# EasyEDA schematic SCH_airPi_2024-02-11.json

## Sheets
1 airPi_HV: TITLE: airPi_HV; REV: 1.0; Date: 2023-12-18; Sheet: 1/1; Drawn By: Wollwolke
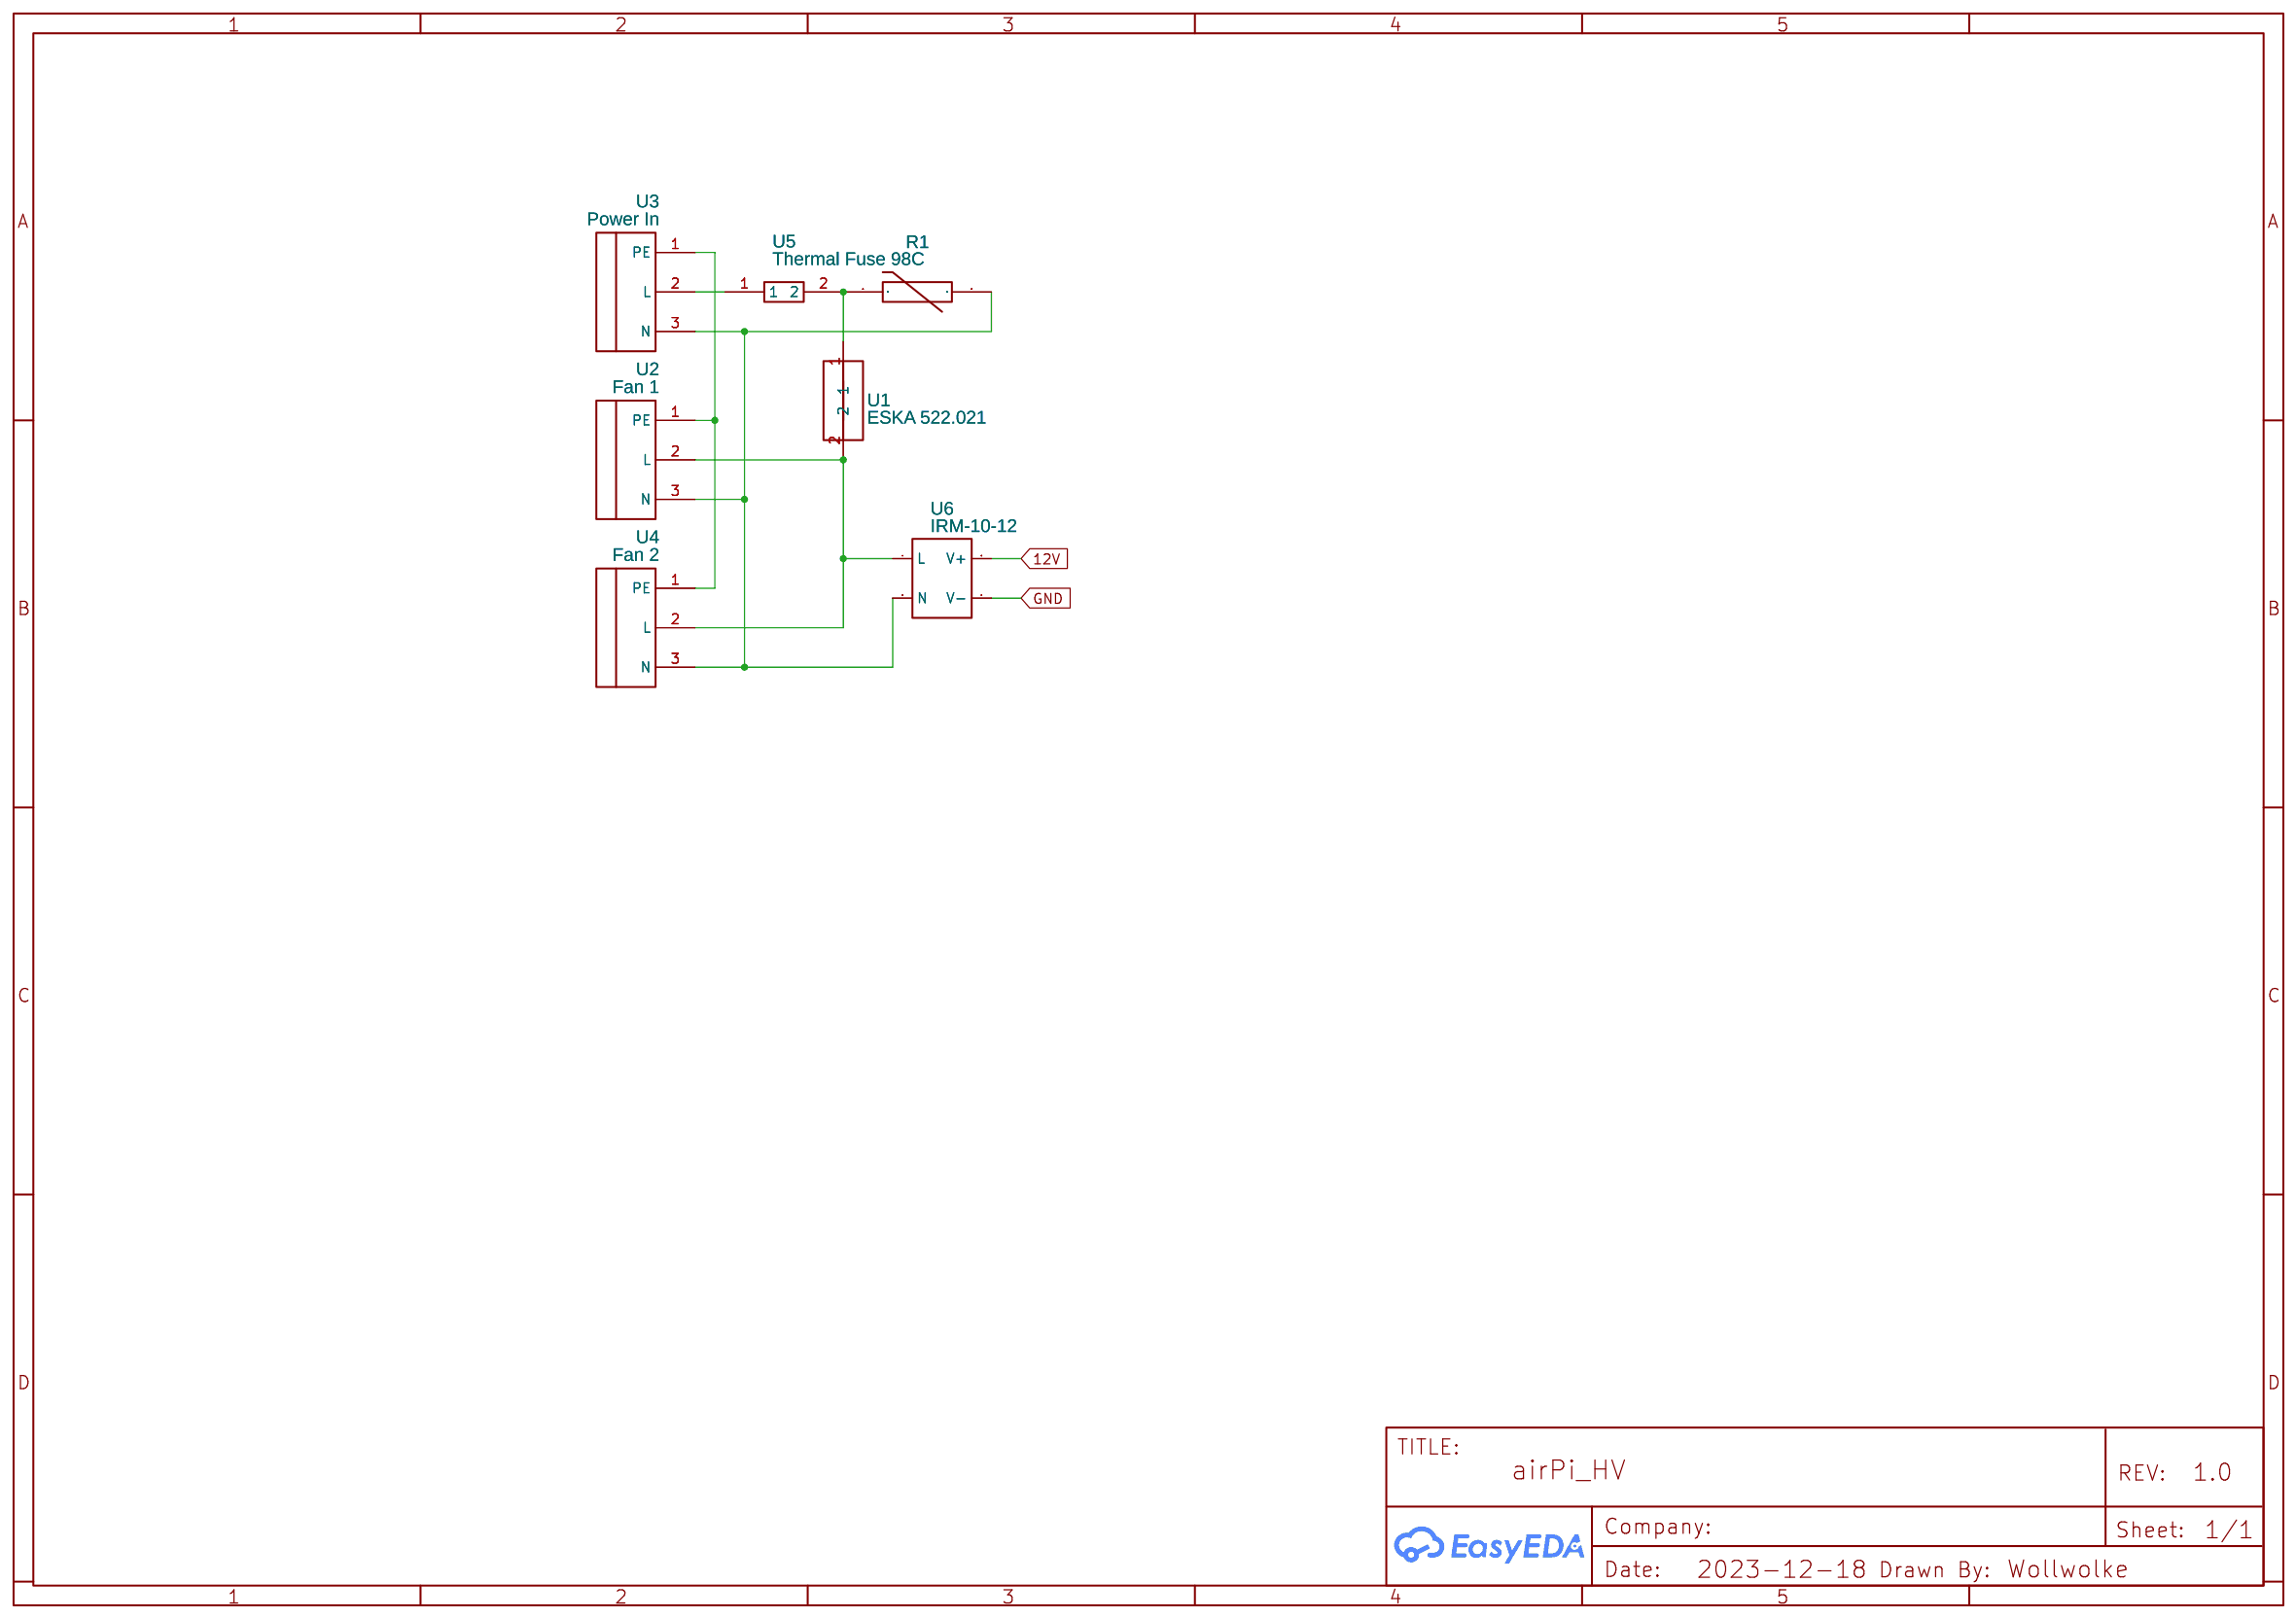
[diagram p0: airPi_HV]
2 airPi_Controller: TITLE: airPi_Controller
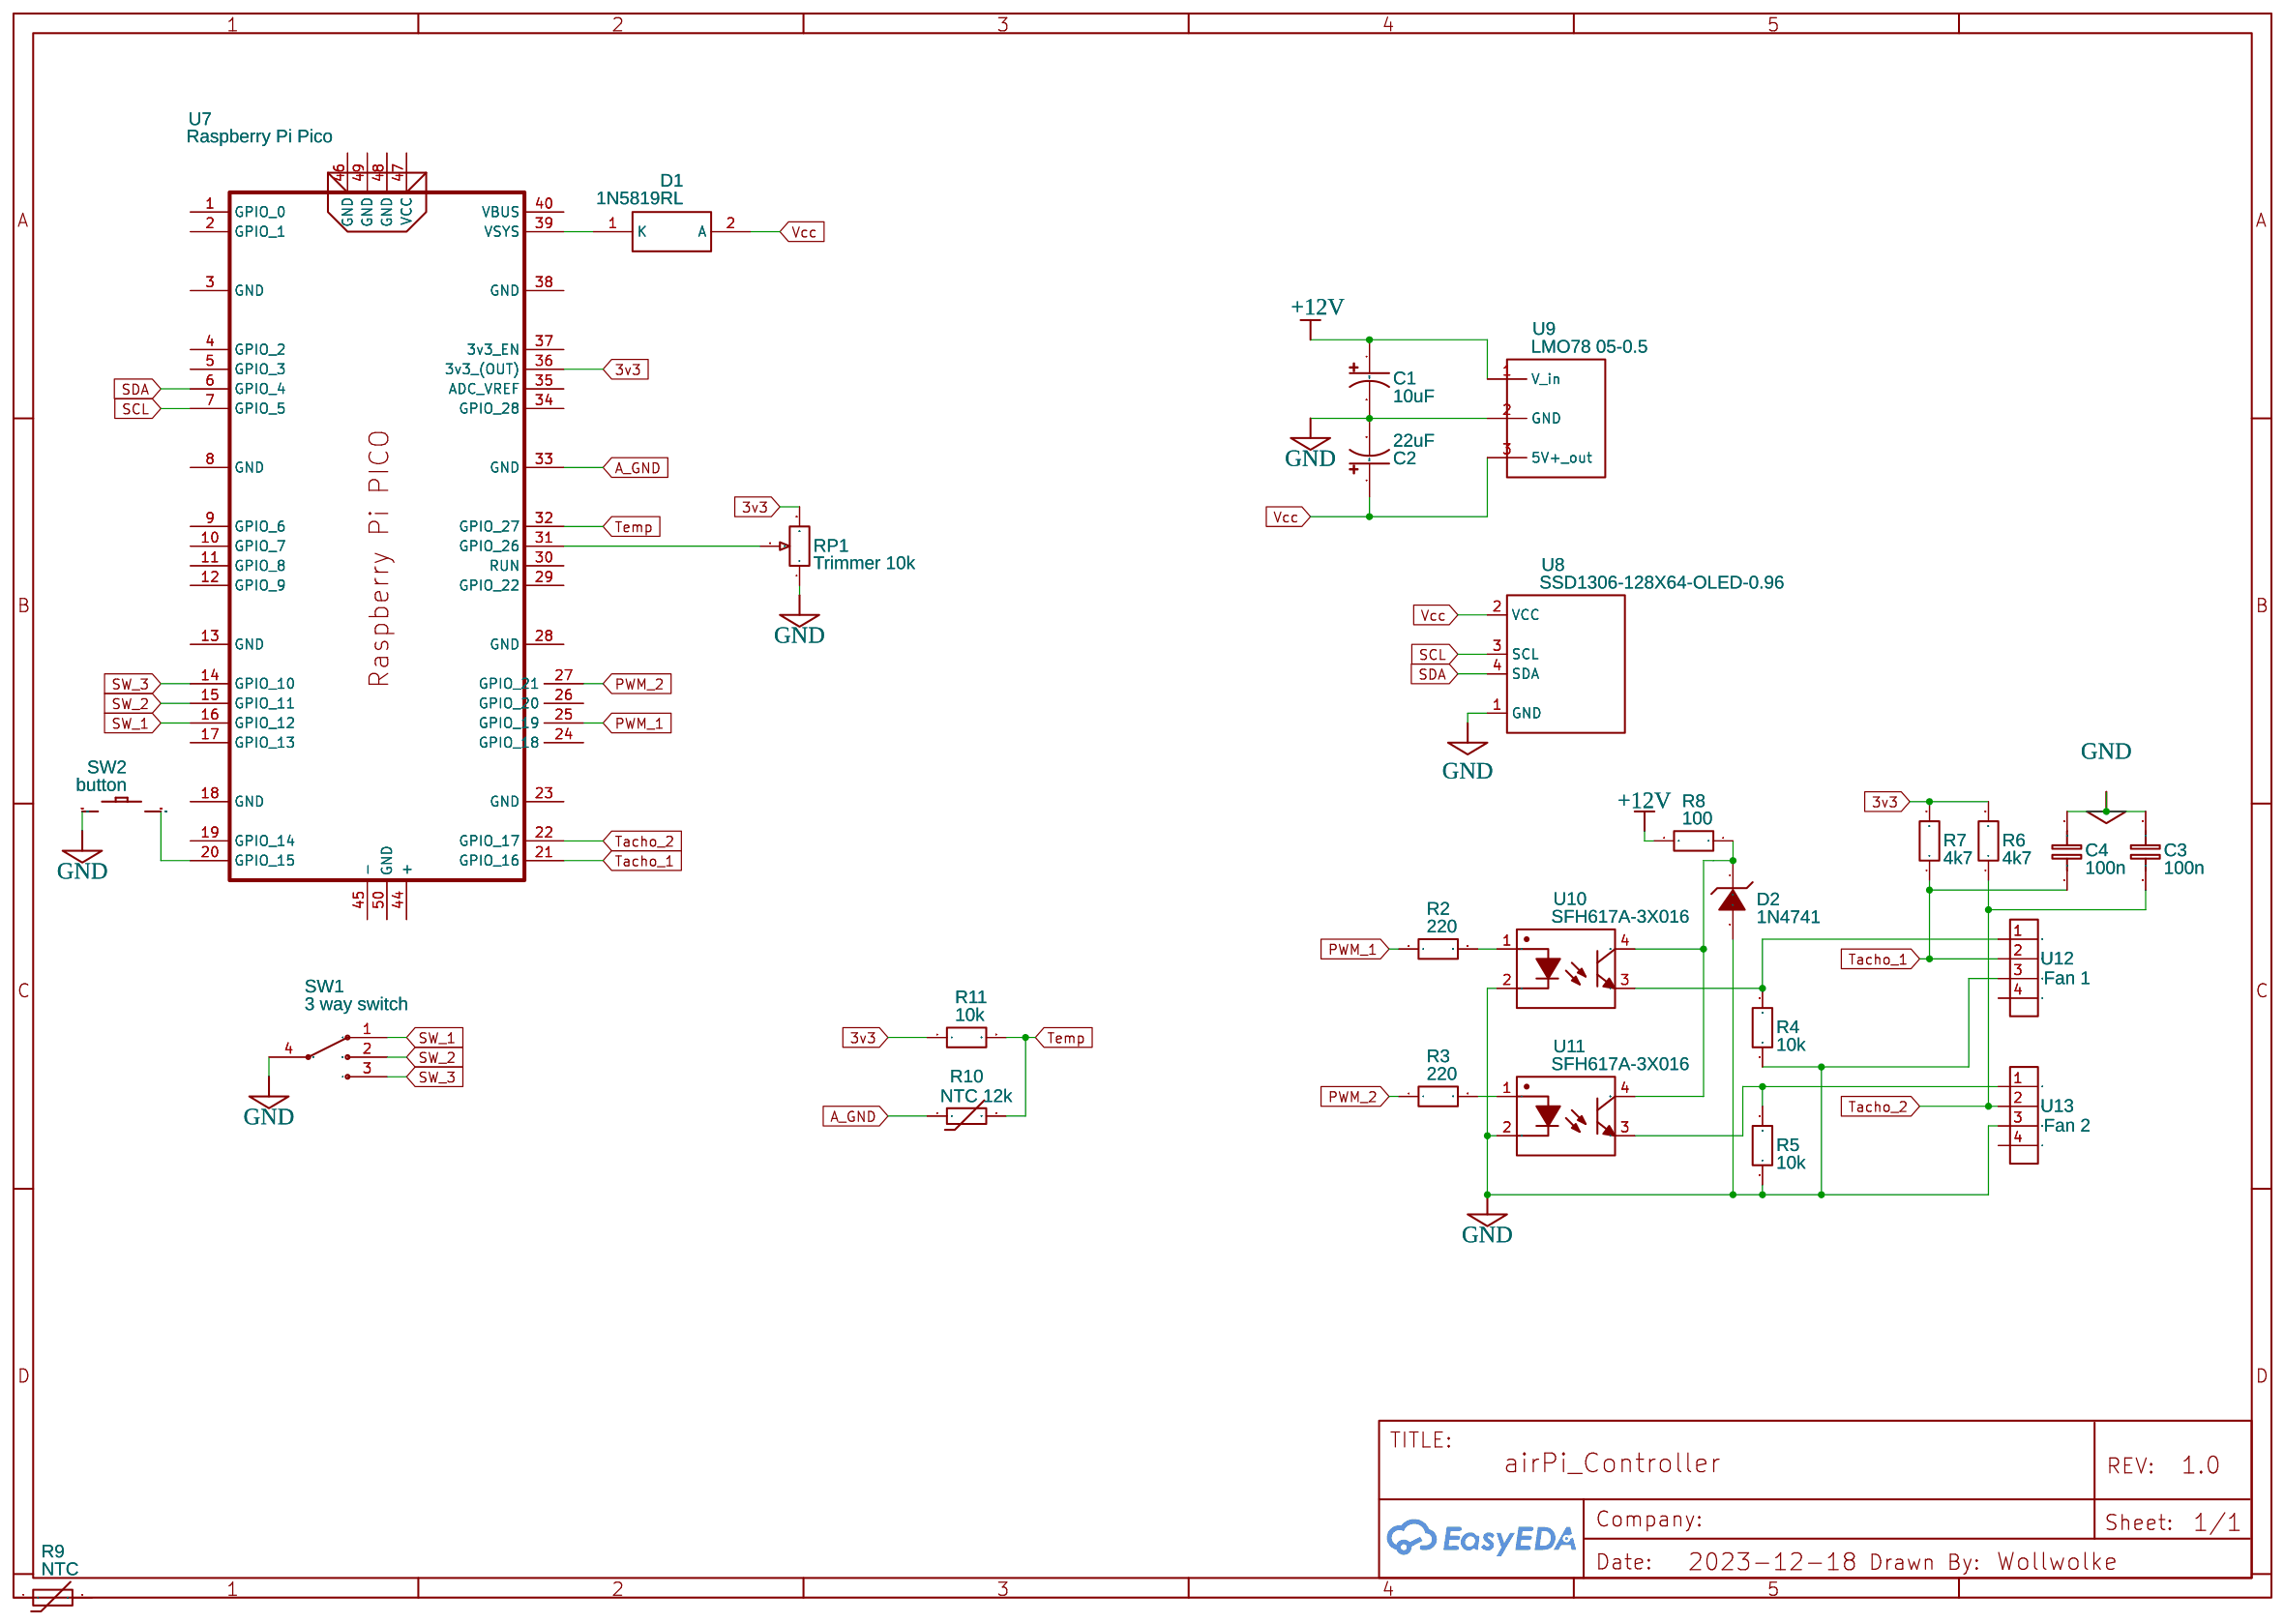
[diagram p1: airPi_Controller]

## Parts
sheet airPi_Controller
C1  10uF  [TANTALUM]
C2  22uF  [TANTALUM]
C3  100n  [C0603]
C4  100n  [C0603]
D1  1N5819RL  [ONSC-AXIAL_LEAD-2-59-10_P]
D2  1N4741  [DO-41_BD2.4-L4.7-P8.70-D0.9-RD]
R2  220  [R0603]
R3  220  [R0603]
R4  10k  [R0603]
R5  10k  [R0603]
R6  4k7  [R0603]
R7  4k7  [R0603]
R8  100  [R0603]
R9  NTC  [RES-TH_L10.5-W5.5-P7.50-D0.6-S5.50]
R10  NTC 12k  [RES-TH_L10.5-W5.5-P7.50-D0.6-S5.50]
R11  10k  [R0603]
RP1  Trimmer 10k  [RES-ADJ-TH_3386P]
SW1  3 way switch  [3 WAY SWITCH SMT]
SW2  button  [32TEETH---CONDUCTIVE-BUTTONS_CONDUCTIVE_BUTTON_DIRECTIONAL_THICK]
U7  Raspberry Pi Pico  [RASPBERRY PI PICO/ RASPBERRY PI PICO W]
U8  SSD1306-128X64-OLED-0.96  [SSD1306]
U9  LMO78 05-0.5  [5V DC/DC]
U10  SFH617A-3X016  [DIP-4_L6.5-W4.6-P2.54-LS10.2-BL]
U11  SFH617A-3X016  [DIP-4_L6.5-W4.6-P2.54-LS10.2-BL]
U12  Fan 1  [MOLEX_MINIFIT-JR-5569]
U13  Fan 2  [MOLEX_MINIFIT-JR-5569]
sheet airPi_HV
R1  Varistor  [B72220S0301K101]
U1  ESKA 522.021  [ESKA 380]
U2  Fan 1  [CONN-TH_3P-P5.08_1757255]
U3  Power In  [CONN-TH_3P-P5.08_1757255]
U4  Fan 2  [CONN-TH_3P-P5.08_1757255]
U5  Thermal Fuse 98C  [THERMAL FUSE]
U6  IRM-10-12  [IRM-10-12]

## Library data of the parts
C1 C2 = TANTALE-10µF: Contributor: hafiz_8030
C3 C4 = C_0603_EU: Contributor: LCEDA_Lib
D1 = 1N5819RL: Rectifier, 2-Pin Axial_Lead, Pb-Free, Tape and Reel
D2 = 1N4741A_C238927: Contributor: LCSC; Supplier: LCSC; Supplier Part: C238927; Manufacturer: onsemi(安森美); Manufacturer Part: 1N4741A; JLCPCB Part Class: Extended Part
R2-R8 R11 = R_0603_EU: Contributor: LCEDA_Lib
R9 R10 = NTC 5D-9: Supplier: LCSC; Manufacturer: RUILON(瑞隆源); Manufacturer Part: NTC 5D-9(弯脚); Supplier Part: C3789; JLCPCB Part Class: Extended Part
RP1 = R_3386P_EU: Supplier: LCSC; Contributor: LCEDA_Lib; Value(Ω): 10K
SW1 = 3 way switch: Supplier Part: C21381; Manufacturer: ReliaPro; Manufacturer Part: MSK-11027 Toggle Switches; image: http://image.lceda.cn/szlcsc/C21381.jpg; Contributor: ClivePCBDesign
SW2 = button: Contributor: laura.puyet1
U7 = Raspberry Pi Pico: Contributor: grawik
U8 = SSD1306-128X64-OLED-0.96: sourceId: wICUcuL3l; Contributor: Think Service
U9 = 5V DC/DC Converter Gaptec LMO78 05-0.5 2,5W: Contributor: Martin Heiter
U10 U11 = SFH617A-3X016: Contributor: lcsc; Supplier: LCSC; Supplier Part: C5273047; Manufacturer: VISHAY(威世)
U12 U13 = MolexMiniFit Jr 02*02: Contributor: s1atbewie.de
R1 = B72220S0301K551: Manufacturer: EPCOS - TDK Electronics; Supplier: Digi-Key; Supplier Part: 495-6539-1-ND; link: https://www.digikey.com/en/products/detail/epcos-tdk-electronics/B72220S0301K101/651287?s=N4IgTCBcDaIEIHYzIAwGUUGYUEYDSOuIAugL5A; Contributor: johncurtin; Package Display: No
U1 = ESKA 380: Manufacturer Part: 2050000172717; link: https://www.conrad.de/de/eska-380000-sicherungshalter-passend-fuer-flachsicherung-standard-20-a-32-vdc-1-st-534048.html#downloadcenter; Contributor: Rhome
U2-U4 = MSTBA 2,5/ 3-G-5,08: Contributor: lcsc; Supplier: LCSC; Supplier Part: C5183941; Manufacturer: Phoenix Contact(菲尼克斯); JLCPCB Part Class: Extended Part
U5 = Thermal Fuse ESKA: Manufacturer: ESKA; Manufacturer Part: 777.098; Contributor: ljeff
U6 = IRM-10-12: Manufacturer: MEAN WELL USA Inc.; Supplier: Digi-Key; Supplier Part: 1866-3028-ND; link: https://www.meanwellusa.com/upload/pdf/IRM-10/IRM-10-spec.pdf; Contributor: energybank

## Nets
3v3: R6.2 R7.2 R11.1 RP1.3 U7.36(3v3 (OUT))
12V: U6.V+
+12V: C1.1 R8.2 U9.1(V_in)
GND: C1.2 C2.2 C3.2 C4.2 D2.2(A) R4.1 R5.1 RP1.1 SW1.4(2) SW2.P$ACTIVE U6.V- U8.1(GND) U9.2(GND) U10.2(C) U11.2(C) U12.3 U13.3
Vcc: C2.1 D1.2(A) U8.2(VCC) U9.3(5V+ out)
A_GND: R10.1 U7.33(GND)
PWM_1: R2.1 U7.25(GPIO 19)
PWM_2: R3.1 U7.27(GPIO 21)
SCL: U7.7(GPIO 5) U8.3(SCL)
SDA: U7.6(GPIO 4) U8.4(SDA)
SW_1: SW1.1 U7.16(GPIO 12)
SW_2: SW1.2(3) U7.15(GPIO 11)
SW_3: SW1.3(4) U7.14(GPIO 10)
Tacho_1: C4.1 R7.1 U7.21(GPIO 16) U12.2
Tacho_2: C3.1 R6.1 U7.22(GPIO 17) U13.2
Temp: R10.2 R11.2 U7.32(GPIO 27)
Net-(D1-1): D1.1(K) U7.39(VSYS)
Net-(D2-1): D2.1(K) R8.1 U10.4(C) U11.4(C)
Net-(R1-1): R1.1 U2.3(N) U3.3(N) U4.3(N) U6.N
Net-(R1-2): R1.2 U1.1 U5.2
Net-(R2-2): R2.2 U10.1(A)
Net-(R3-2): R3.2 U11.1(A)
Net-(R4-2): R4.2 U10.3(E) U12.1
Net-(R5-2): R5.2 U11.3(E) U13.1
Net-(RP1-2): RP1.2 U7.31(GPIO 26)
Net-(SW2-P$GND): SW2.P$GND U7.20(GPIO 15)
Net-(U1-2): U1.2 U2.2(L) U4.2(L) U6.L
Net-(U2-1): U2.1(PE) U3.1(PE) U4.1(PE)
Net-(U3-2): U3.2(L) U5.1

Not connected (* = marked no-connect by the designer): R9 1 2; U7 1(GPIO 0) 2(GPIO 1) 3(GND) 4(GPIO 2) 5(GPIO 3) 8(GND) 9(GPIO 6) 10(GPIO 7) 11(GPIO 8) 12(GPIO 9) 13(GND) 17(GPIO 13) 18(GND) 19(GPIO 14) 23(GND) 24(GPIO 18) 26(GPIO 20) 28(GND) 29(GPIO 22) 30(RUN) 34(GPIO 28) 35(ADC_VREF) 37(3v3_EN) 38(GND) 40(VBUS) 44(+) 45(-) 46(GND) 47(VCC) 48(GND) 49(GND) 50(GND); U12 4; U13 4
